# Altium schematic sheet Current Sense.SchDoc
size A3; SheetNumber: 4; SheetTotal: 5
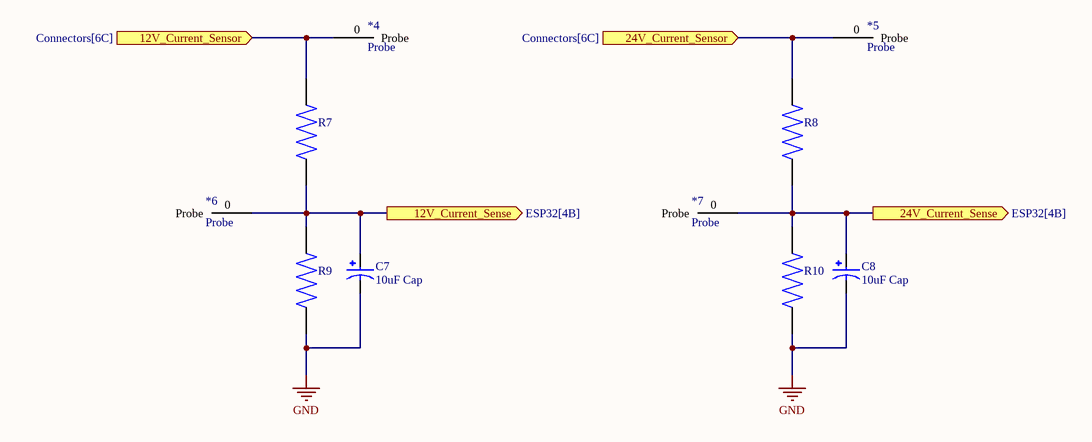
[diagram p0: Current Sense.SchDoc]

## Parts
*4  Probe  [Probe]
*5  Probe  [Probe]
*6  Probe  [Probe]
*7  Probe  [Probe]
C7  10uF Cap  [CAP_10uF]
C8  10uF Cap  [CAP_10uF]
R7  Resistor_Through Hole  [Resistor_Through Hole]  (value not drawn)
R8  Resistor_Through Hole  [Resistor_Through Hole]  (value not drawn)
R9  Resistor_Through Hole  [Resistor_Through Hole]  (value not drawn)
R10  Resistor_Through Hole  [Resistor_Through Hole]  (value not drawn)

## Ports
12V_Current_Sense (out, see ESP32[4B]), 12V_Current_Sensor (in, see Connectors[6C]), 24V_Current_Sense (out, see ESP32[4B]), 24V_Current_Sensor (in, see Connectors[6C])

## Nets
GND: C7.N C8.N R9.1 R10.1
12V_Current_Sense: *6.0(Probe) C7.P R7.1 R9.2 ; port 12V_Current_Sense
12V_Current_Sensor: *4.0(Probe) R7.2 ; port 12V_Current_Sensor
24V_Current_Sense: *7.0(Probe) C8.P R8.1 R10.2 ; port 24V_Current_Sense
24V_Current_Sensor: *5.0(Probe) R8.2 ; port 24V_Current_Sensor

## Library data of the parts
C7 C8 = 10uF Cap: CAP ALUM 10UF 20% 50V RADIAL; MP: ECE-A1HN100UI; MF: Panasonic; SnapEDA_Link: https://www.snapeda.com/parts/ECE-A1HN100UI/Panasonic/view-part/2321690/?ref=snap; Price: None; Check_prices: https://www.snapeda.com/parts/ECE-A1HN100UI/Panasonic/view-part/2321690/?ref=eda; Value: *; Availability: In Stock; Package: RADIAL-2 Panasonic
R7-R10 = Resistor_Through Hole: 1.02 Ohms Â±1% 0.25W, 1/4W Through Hole Resistor Axial Metal Film; MP: MFR-25FTE52-1R; MF: Yageo; Availability: Warning; Value: *; Check_prices: https://www.snapeda.com/parts/MFR-25FTE52-1R/Yageo/view-part/4629919/?ref=eda; Package: Axial Yageo; Price: None; SnapEDA_Link: https://www.snapeda.com/parts/MFR-25FTE52-1R/Yageo/view-part/4629919/?ref=snap; Purchase-URL: https://pricing.snapeda.com/search/part/MFR-25FTE52-1R/?ref=eda